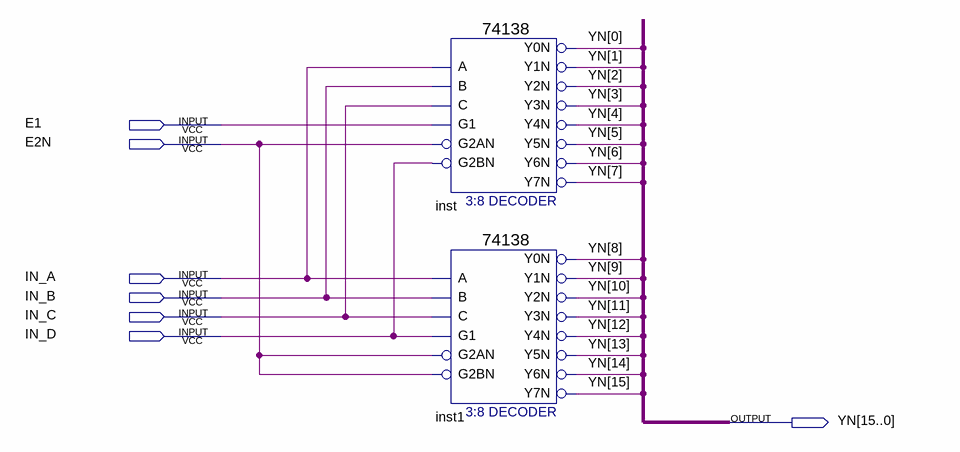
[diagram p0: schematic sheet]
// Quartus schematic 4_16_Decoder.bdf as structural Verilog: 2 symbols, 7 pins
module \4_16_Decoder  (
  input  E1,
  input  E2N,
  input  IN_A,
  input  IN_B,
  input  IN_C,
  input  IN_D,
  output [15:0] YN
);

  \74138  inst (
    .A(IN_A), .B(IN_B), .G1(E1), .C(IN_C), .G2AN(E2N), .G2BN(IN_D), .Y0N(YN[0]), .Y1N(YN[1]), .Y2N(YN[2]),
    .Y3N(YN[3]), .Y4N(YN[4]), .Y5N(YN[5]), .Y6N(YN[6]), .Y7N(YN[7]));
  \74138  inst1 (
    .A(IN_A), .B(IN_B), .G1(IN_D), .C(IN_C), .G2AN(E2N), .G2BN(E2N), .Y0N(YN[8]), .Y1N(YN[9]), .Y2N(YN[10]),
    .Y3N(YN[11]), .Y4N(YN[12]), .Y5N(YN[13]), .Y6N(YN[14]), .Y7N(YN[15]));
endmodule
